# EAGLE schematic secondcompletion (EAGLE 6.0)
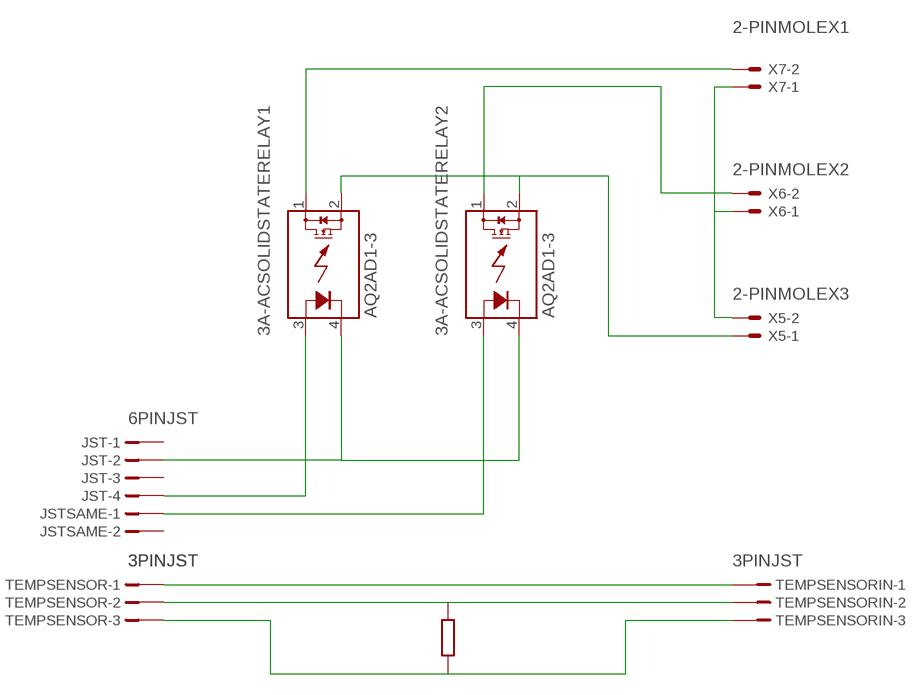
[diagram p0: schematic, sheet 1]

## Parts
JST  B4B-ZR  [B4B-ZR]
JSTSAME  B4B-ZR  [B4B-ZR]
K1  AQ2AD1-3  [AQ1]
K2  AQ2AD1-3  [AQ1]
TEMPSENSOR  B4B-ZR  [B4B-ZR]
TEMPSENSORIN  B4B-ZR  [B4B-ZR]
X5  22-23-2021  [22-23-2021]
X6  22-23-2021  [22-23-2021]
X7  22-23-2021  [22-23-2021]

## Nets
2-PINMOLEX1: K1.1(DS1) X7.2
2-PINMOLEX2: K2.1(DS1) X6.2
2-PINMOLEX3: X5.2 X6.1 X7.1
3A-ACSOLIDSTATERELAY1: JST.4 K1.3(A)
3A-ACSOLIDSTATERELAY2: JSTSAME.1 K2.3(A)
3PINJST: TEMPSENSOR.1 TEMPSENSORIN.1
6PINJST: JST.2 K1.4(K) K2.4(K)
N$2: TEMPSENSOR.2 TEMPSENSORIN.2
N$3: TEMPSENSOR.3 TEMPSENSORIN.3
N$4: K1.2(DS2) K2.2(DS2) X5.1
Unconnected: JST.1 JST.3 JSTSAME.2 JSTSAME.3 JSTSAME.4 TEMPSENSOR.4 TEMPSENSORIN.4

## Library data of the parts
JST JSTSAME TEMPSENSOR TEMPSENSORIN = con-jst:?4B-ZR: ZH CONNECTOR 1.5 mm, 4 pin 1 row Source: http://www.jst.com .. eZH.pdf; MF: FARNELL; MPN: B4B-ZR(LF)(SN); OC_FARNELL: 1830916; OC_NEWARK: 37K9960
K1 K2 = relay:AQ*: SOLID STATE RELAY NAiS Source: http://www.mew-europe.com/.. en_ds_61601_0000.pdf; MPN: AQ2AD1-3/28VDC; OC_FARNELL: unknown; OC_NEWARK: 13P1229
X5-X7 = con-molex:22-23-2021: .100" (2.54mm) Center Header - 2 Pin; MF: MOLEX; MPN: 22-23-2021; OC_FARNELL: 1462926; OC_NEWARK: 25C3832